# Altium project AM3358_DEV_BOARD.PrjPcb (part 1 of 3)
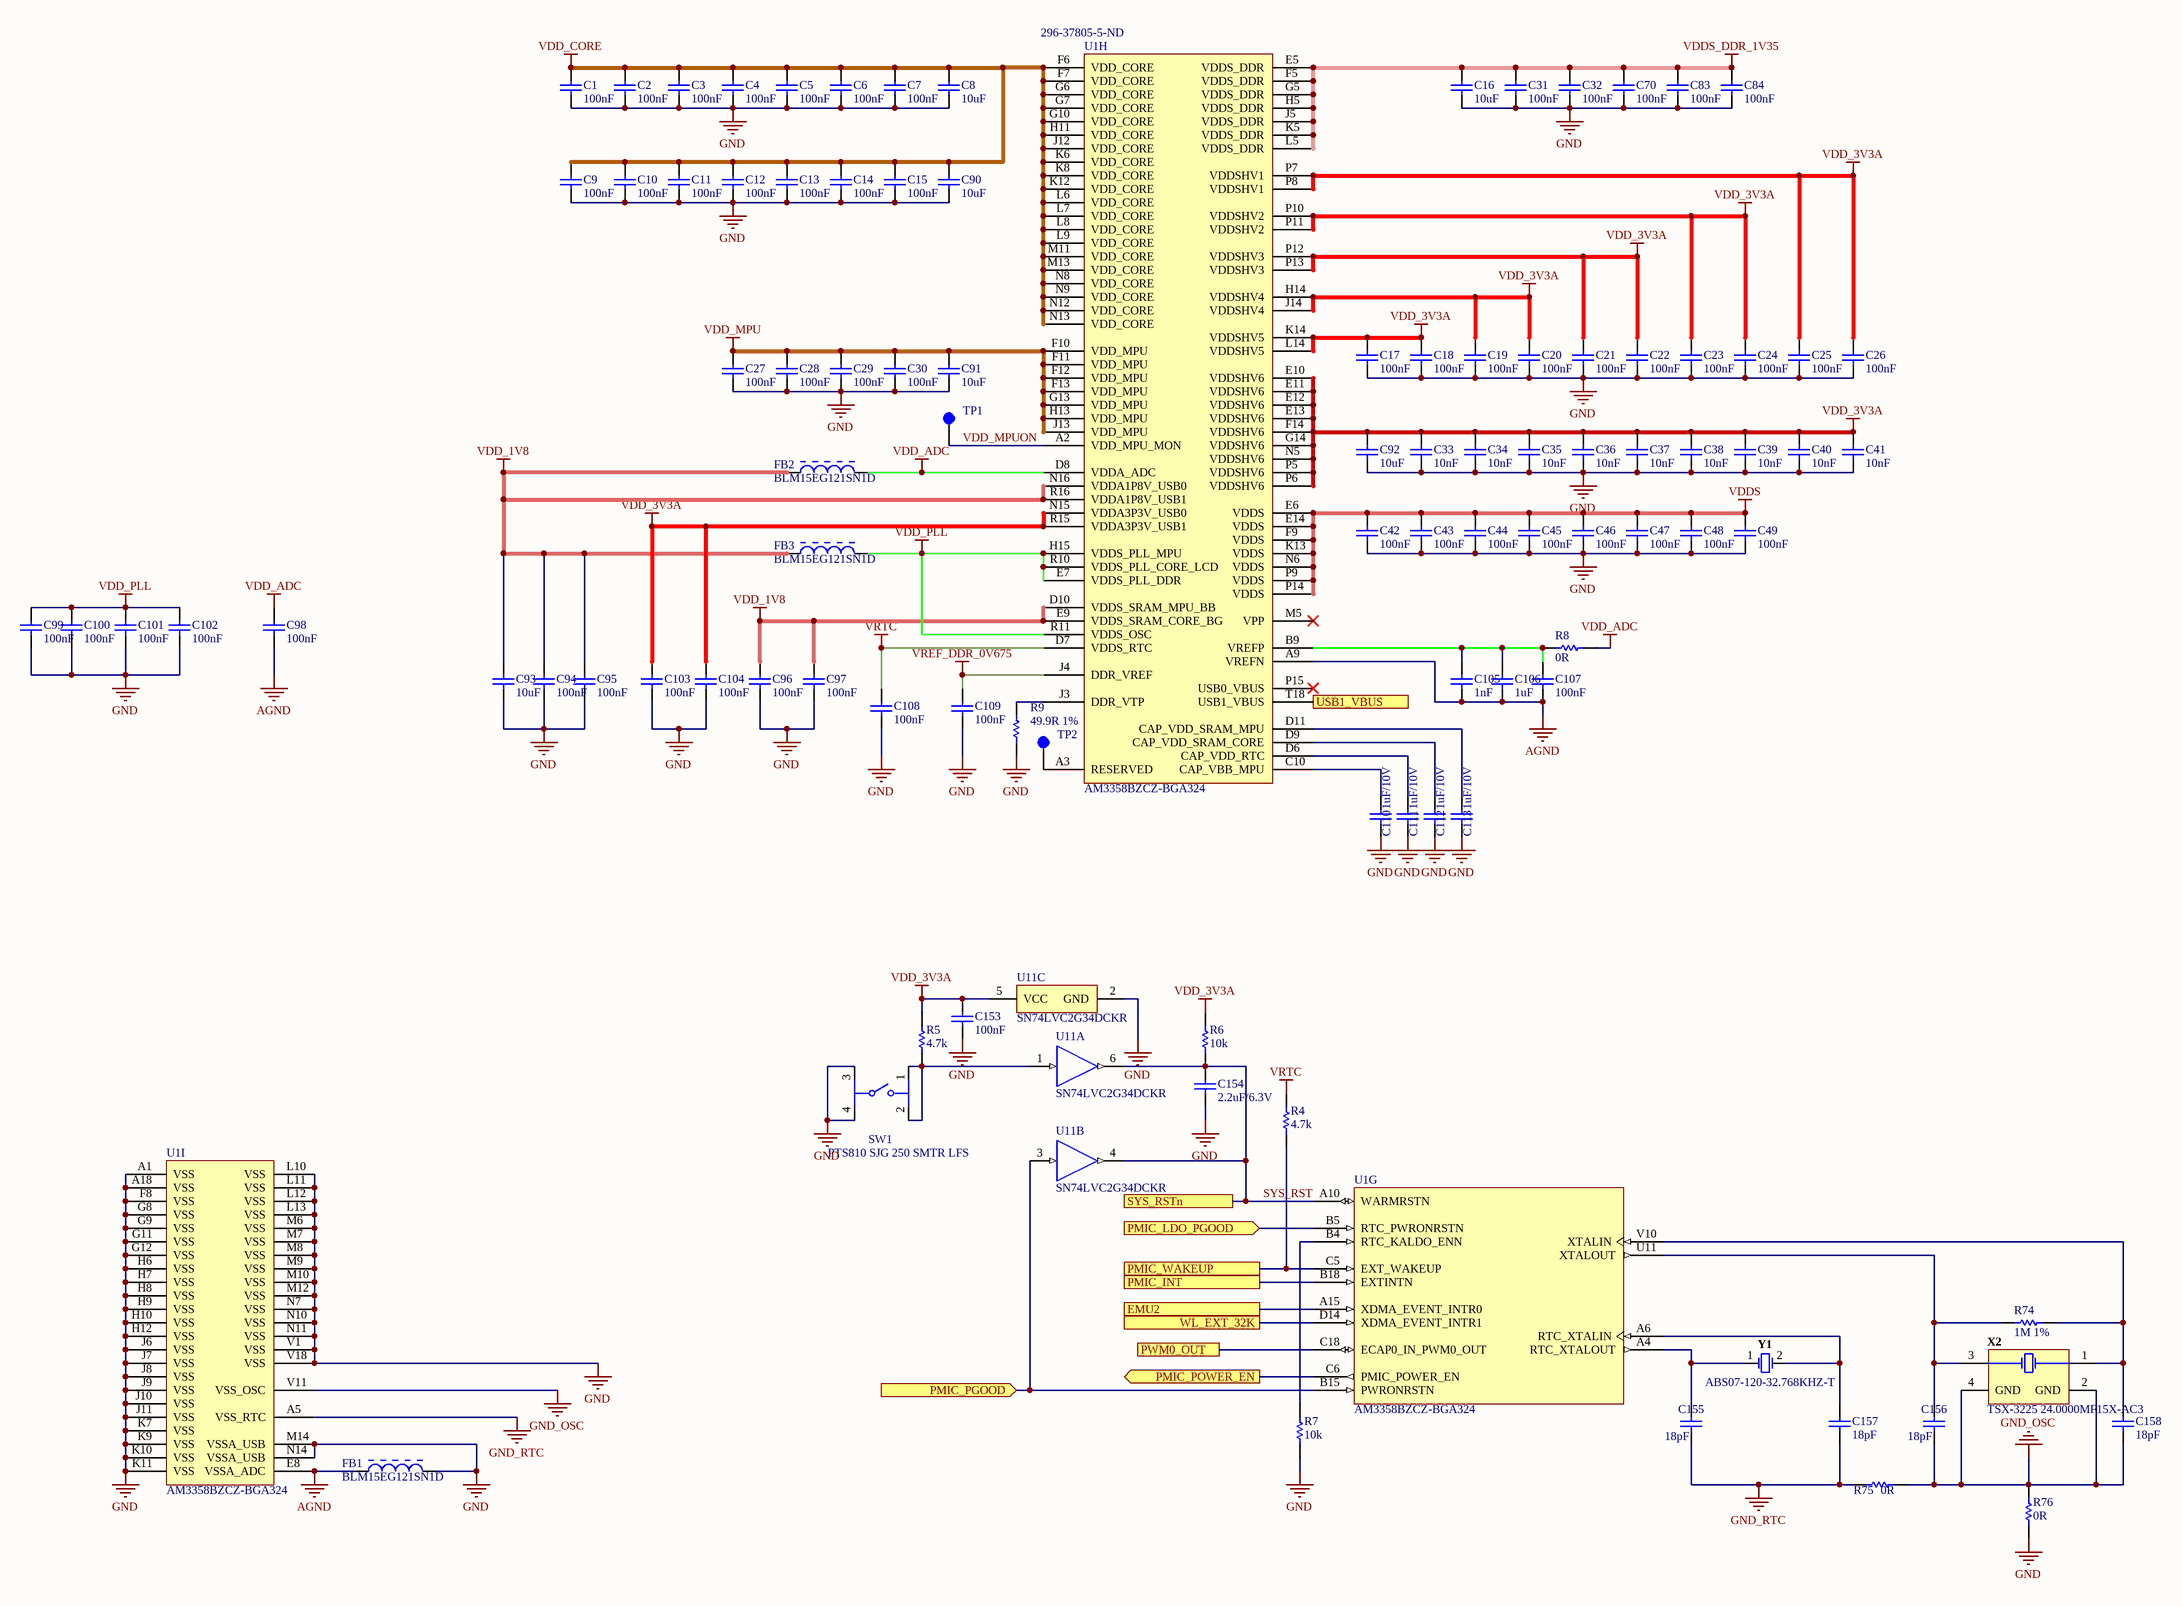
[diagram p0: 03. POWER.SchDoc]
10 sheets, 341 parts. Net scope: flat (ports and power ports of the same name join across sheets).
Board file: AM3358_DEV.PcbDoc
Sheets:
  03. POWER.SchDoc
  04. DDRAM.SchDoc
  05. LCD.SchDoc
  06. ETHERNET.SchDoc
  07. WIFI.SchDoc
  09. SDIO, PERIPHERAL.SchDoc
  08. PMIC.SchDoc
  10. eMMC.SchDoc
  11. USB.SchDoc
  12. uSD.SchDoc

## Sheet 03. POWER.SchDoc
size A2

### Parts
C1  100nF  [CAPC1005X60X30LL05T10]
C2  100nF  [CAPC1005X60X30LL05T10]
C3  100nF  [CAPC1005X60X30LL05T10]
C4  100nF  [CAPC1005X60X30LL05T10]
C5  100nF  [CAPC1005X60X30LL05T10]
C6  100nF  [CAPC1005X60X30LL05T10]
C7  100nF  [CAPC1005X60X30LL05T10]
C8  10uF  [CAPC1005X60X30LL05T10]
C9  100nF  [CAPC1005X60X30LL05T10]
C10  100nF  [CAPC1005X60X30LL05T10]
C11  100nF  [CAPC1005X60X30LL05T10]
C12  100nF  [CAPC1005X60X30LL05T10]
C13  100nF  [CAPC1005X60X30LL05T10]
C14  100nF  [CAPC1005X60X30LL05T10]
C15  100nF  [CAPC1005X60X30LL05T10]
C16  10uF  [CAPC1608X90X35NL10T15]
C17  100nF  [CAPC1005X60X30LL05T10]
C18  100nF  [CAPC1005X60X30LL05T10]
C19  100nF  [CAPC1005X60X30LL05T10]
C20  100nF  [CAPC1005X60X30LL05T10]
C21  100nF  [CAPC1005X60X30LL05T10]
C22  100nF  [CAPC1005X60X30LL05T10]
C23  100nF  [CAPC1005X60X30LL05T10]
C24  100nF  [CAPC1005X60X30LL05T10]
C25  100nF  [CAPC1005X60X30LL05T10]
C26  100nF  [CAPC1005X60X30LL05T10]
C27  100nF  [CAPC1005X60X30LL05T10]
C28  100nF  [CAPC1005X60X30LL05T10]
C29  100nF  [CAPC1005X60X30LL05T10]
C30  100nF  [CAPC1005X60X30LL05T10]
C31  100nF  [CAPC1005X60X30LL05T10]
C32  100nF  [CAPC1005X60X30LL05T10]
C33  10nF  [CAPC1005X60X30LL05T10]
C34  10nF  [CAPC1005X60X30LL05T10]
C35  10nF  [CAPC1005X60X30LL05T10]
C36  10nF  [CAPC1005X60X30LL05T10]
C37  10nF  [CAPC1005X60X30LL05T10]
C38  10nF  [CAPC1005X60X30LL05T10]
C39  10nF  [CAPC1005X60X30LL05T10]
C40  10nF  [CAPC1005X60X30LL05T10]
C41  10nF  [CAPC1005X60X30LL05T10]
C42  100nF  [CAPC1005X60X30LL05T10]
C43  100nF  [CAPC1005X60X30LL05T10]
C44  100nF  [CAPC1005X60X30LL05T10]
C45  100nF  [CAPC1005X60X30LL05T10]
C46  100nF  [CAPC1005X60X30LL05T10]
C47  100nF  [CAPC1005X60X30LL05T10]
C48  100nF  [CAPC1005X60X30LL05T10]
C49  100nF  [CAPC1005X60X30LL05T10]
C70  100nF  [CAPC1005X60X30LL05T10]
C83  100nF  [CAPC1005X60X30LL05T10]
C84  100nF  [CAPC1005X60X30LL05T10]
C90  10uF  [CAPC1005X60X30LL05T10]
C91  10uF  [RESC1005X40X25LL05T05]
C92  10uF  [CAPC1608X90X35NL10T15]
C93  10uF  [CAPC1608X90X35NL10T15]
C94  100nF  [CAPC1005X60X30LL05T10]
C95  100nF  [CAPC1005X60X30LL05T10]
C96  100nF  [CAPC1005X60X30LL05T10]
C97  100nF  [CAPC1005X60X30LL05T10]
C98  100nF  [RESC1005X40X25LL05T05]
C99  100nF  [RESC1005X40X25LL05T05]
C100  100nF  [RESC1005X40X25LL05T05]
C101  100nF  [RESC1005X40X25LL05T05]
C102  100nF  [RESC1005X40X25LL05T05]
C103  100nF  [CAPC1005X60X30LL05T10]
C104  100nF  [CAPC1005X60X30LL05T10]
C105  1nF  [CAPC1005X60X30LL05T10]
C106  1uF  [CAPC1005X55X25NL05T10]
C107  100nF  [CAPC1005X60X30LL05T10]
C108  100nF  [CAPC1005X60X30LL05T10]
C109  100nF  [CAPC1005X60X30LL05T10]
C110  1uF/10V  [CAPC1005X55X25NL05T10]
C111  1uF/10V  [CAPC1005X55X25NL05T10]
C112  1uF/10V  [CAPC1005X55X25NL05T10]
C113  1uF/10V  [CAPC1005X55X25NL05T10]
C153  100nF  [CAPC1005X55X25LL05T10]
C154  2.2uF/6.3V  [CAPC1005X60X30LL05T10]
C155  18pF  [CAPC1005X60X30LL05T10]
C156  18pF  [CAPC1005X60X30LL05T10]
C157  18pF  [CAPC1005X60X30LL05T10]
C158  18pF  [CAPC1005X60X30LL05T10]
FB1  BLM15EG121SN1D  [MURA-BLM15-CHIP-2_V]
FB2  BLM15EG121SN1D  [MURA-BLM15-CHIP-2_V]
FB3  BLM15EG121SN1D  [MURA-BLM15-CHIP-2_V]
R4  4.7k  [RESC1005X40X25LL05T05]
R5  4.7k  [RESC1005X40X25LL05T05]
R6  10k  [RESC1005X40X25LL05T05]
R7  10k  [RESC1005X40X25LL05T05]
R8  0R  [RESC1005X40X25LL05T05]
R9  49.9R 1%  [RESC1005X40X25LL05T05]
R74  1M 1%  [RESC1005X40X25LL05T05]
R75  0R  [RESC1005X40X25LL05T05]
R76  0R  [RESC1005X40X25LL05T05]
SW1  PTS810 SJG 250 SMTR LFS  [FP-PTS810_SJG_250_SMTR_LF-MFG]
TP1  Test Point  [TP]  (value not drawn)
TP2  Test Point  [TP]  (value not drawn)
U1  AM3358BZCZ-BGA324  [TI-ZCZ324]  (parts G,H,I of 11)
U11  SN74LVC2G34DCKR  [DCK0006A_L]  (parts A,B,C of 3)
X2  TSX-3225 24.0000MF15X-AC3  [FP-NX3225SA-MFG]
Y1  ABS07-120-32.768KHZ-T  [ABRA-ABS07_A_V]

### Ports
EMU2, PMIC_INT, PMIC_LDO_PGOOD (in), PMIC_PGOOD (in), PMIC_POWER_EN (out), PMIC_WAKEUP, PWM0_OUT, SYS_RSTn, USB1_VBUS, WL_EXT_32K

### Nets
AGND: C98.1 C105.1 C106.1 C107.1 FB1.1 U1.A9(VREFN) U1.E8(VSSA_ADC)
GND: C1.1 C2.1 C3.1 C4.1 C5.1 C6.1 C7.1 C8.1 C9.1 C10.1 C11.1 C12.1 C13.1 C14.1 C15.1 C16.1 C17.1 C18.1 C19.1 C20.1 C21.1 C22.1 C23.1 C24.1 C25.1 C26.1 C27.1 C28.1 C29.1 C30.1 C31.1 C32.1 C33.1 C34.1 C35.1 C36.1 C37.1 C38.1 C39.1 C40.1 C41.1 C42.1 C43.1 C44.1 C45.1 C46.1 C47.1 C48.1 C49.1 C70.1 C83.1 C84.1 C90.1 C91.1 C92.1 C93.1 C94.1 C95.1 C96.1 C97.1 C99.1 C100.1 C101.1 C102.1 C103.1 C104.1 C108.1 C109.1 C110.1 C111.1 C112.1 C113.1 C153.1 C154.1 FB1.2 R7.1 R9.1 R76.1 SW1.3 SW1.4 U1.A1(VSS) U1.A18(VSS) U1.F8(VSS) U1.G8(VSS) U1.G9(VSS) U1.G11(VSS) U1.G12(VSS) U1.H6(VSS) U1.H7(VSS) U1.H8(VSS) U1.H9(VSS) U1.H10(VSS) U1.H12(VSS) U1.J6(VSS) U1.J7(VSS) U1.J8(VSS) U1.J9(VSS) U1.J10(VSS) U1.J11(VSS) U1.K7(VSS) U1.K9(VSS) U1.K10(VSS) U1.K11(VSS) U1.L10(VSS) U1.L11(VSS) U1.L12(VSS) U1.L13(VSS) U1.M6(VSS) U1.M7(VSS) U1.M8(VSS) U1.M9(VSS) U1.M10(VSS) U1.M12(VSS) U1.M14(VSSA_USB) U1.N7(VSS) U1.N10(VSS) U1.N11(VSS) U1.N14(VSSA_USB) U1.V1(VSS) U1.V18(VSS) U11.2(GND)
GND_OSC: C156.1 C158.1 R75.1 R76.2 U1.V11(VSS_OSC) X2.2(GND) X2.4(GND)
GND_RTC: C155.1 C157.1 R75.2 U1.A5(VSS_RTC)
VDD_1V8: C93.2 C94.2 C95.2 C96.2 C97.2 FB2.1 FB3.1 U1.D10(VDDS_SRAM_MPU_BB) U1.E9(VDDS_SRAM_CORE_BG) U1.N16(VDDA1P8V_USB0) U1.R16(VDDA1P8V_USB1)
VDD_3V3A: C17.2 C18.2 C19.2 C20.2 C21.2 C22.2 C23.2 C24.2 C25.2 C26.2 C33.2 C34.2 C35.2 C36.2 C37.2 C38.2 C39.2 C40.2 C41.2 C92.2 C103.2 C104.2 C153.2 R5.1 R6.2 U1.E10(VDDSHV6) U1.E11(VDDSHV6) U1.E12(VDDSHV6) U1.E13(VDDSHV6) U1.F14(VDDSHV6) U1.G14(VDDSHV6) U1.H14(VDDSHV4) U1.J14(VDDSHV4) U1.K14(VDDSHV5) U1.L14(VDDSHV5) U1.N5(VDDSHV6) U1.N15(VDDA3P3V_USB0) U1.P5(VDDSHV6) U1.P6(VDDSHV6) U1.P7(VDDSHV1) U1.P8(VDDSHV1) U1.P10(VDDSHV2) U1.P11(VDDSHV2) U1.P12(VDDSHV3) U1.P13(VDDSHV3) U1.R15(VDDA3P3V_USB1) U11.5(VCC)
VDD_ADC: C98.2 FB2.2 R8.2 U1.D8(VDDA_ADC)
VDD_CORE: C1.2 C2.2 C3.2 C4.2 C5.2 C6.2 C7.2 C8.2 C9.2 C10.2 C11.2 C12.2 C13.2 C14.2 C15.2 C90.2 U1.F6(VDD_CORE) U1.F7(VDD_CORE) U1.G6(VDD_CORE) U1.G7(VDD_CORE) U1.G10(VDD_CORE) U1.H11(VDD_CORE) U1.J12(VDD_CORE) U1.K6(VDD_CORE) U1.K8(VDD_CORE) U1.K12(VDD_CORE) U1.L6(VDD_CORE) U1.L7(VDD_CORE) U1.L8(VDD_CORE) U1.L9(VDD_CORE) U1.M11(VDD_CORE) U1.M13(VDD_CORE) U1.N8(VDD_CORE) U1.N9(VDD_CORE) U1.N12(VDD_CORE) U1.N13(VDD_CORE)
VDD_MPU: C27.2 C28.2 C29.2 C30.2 C91.2 U1.F10(VDD_MPU) U1.F11(VDD_MPU) U1.F12(VDD_MPU) U1.F13(VDD_MPU) U1.G13(VDD_MPU) U1.H13(VDD_MPU) U1.J13(VDD_MPU)
VDD_PLL: C99.2 C100.2 C101.2 C102.2 FB3.2 U1.E7(VDDS_PLL_DDR) U1.H15(VDDS_PLL_MPU) U1.R10(VDDS_PLL_CORE_LCD) U1.R11(VDDS_OSC)
VDDS: C42.2 C43.2 C44.2 C45.2 C46.2 C47.2 C48.2 C49.2 U1.E6(VDDS) U1.E14(VDDS) U1.F9(VDDS) U1.K13(VDDS) U1.N6(VDDS) U1.P9(VDDS) U1.P14(VDDS)
VDDS_DDR_1V35: C16.2 C31.2 C32.2 C70.2 C83.2 C84.2 U1.E5(VDDS_DDR) U1.F5(VDDS_DDR) U1.G5(VDDS_DDR) U1.H5(VDDS_DDR) U1.J5(VDDS_DDR) U1.K5(VDDS_DDR) U1.L5(VDDS_DDR)
VREF_DDR_0V675: C109.2 U1.J4(DDR_VREF)
VRTC: C108.2 R4.1 U1.D7(VDDS_RTC)
JTAG_EMU2: U1.A15(XDMA_EVENT_INTR0) ; port EMU2
JTAG_EMU3: U1.D14(XDMA_EVENT_INTR1) ; port WL_EXT_32K
SYS_RST: C154.2 R6.1 U1.A10(WARMRSTN) U11.4(2Y) U11.6(1Y) ; port SYS_RSTn  [project net ETH_RST]
VDD_MPUON: TP1.1 U1.A2(VDD_MPU_MON)
NetC105_2: C105.2 C106.2 C107.2 R8.1 U1.B9(VREFP)
NetC110_2: C110.2 U1.C10(CAP_VBB_MPU)
NetC111_2: C111.2 U1.D6(CAP_VDD_RTC)
NetC112_2: C112.2 U1.D9(CAP_VDD_SRAM_CORE)
NetC113_2: C113.2 U1.D11(CAP_VDD_SRAM_MPU)
NetC155_2: C155.2 U1.A4(RTC_XTALOUT) Y1.1
NetC156_2: C156.2 R74.1 U1.U11(XTALOUT) X2.3(X2)
NetC157_2: C157.2 U1.A6(RTC_XTALIN) Y1.2
NetC158_2: C158.2 R74.2 U1.V10(XTALIN) X2.1(X1)
NetFB7_1: U1.T18(USB1_VBUS) ; port USB1_VBUS
NetJ7_38: U1.C18(ECAP0_IN_PWM0_OUT) ; port PWM0_OUT
NetR4_2: R4.2 U1.C5(EXT_WAKEUP) ; port PMIC_WAKEUP
NetR5_2: R5.2 SW1.1 SW1.2 U11.1(1A)
NetR7_2: R7.2 U1.B4(RTC_KALDO_ENN)
NetR9_2: R9.2 U1.J3(DDR_VTP)
NetTP2_1: TP2.1 U1.A3(RESERVED)
NetU1_B5: U1.B5(RTC_PWRONRSTN) ; port PMIC_LDO_PGOOD
NetU1_B15: U1.B15(PWRONRSTN) U11.3(2A) ; port PMIC_PGOOD
NetU1_B18: U1.B18(EXTINTN) ; port PMIC_INT
NetU1_C6: U1.C6(PMIC_POWER_EN) ; port PMIC_POWER_EN

Not connected (* = marked no-connect by the designer): U1 M5(VPP)* P15(USB0_VBUS)*

### Notes on the sheet
- Title
- Size:
- Date:
- Design by:
- A4
- Number:
- Time:
- Check by:
- Revision:
- Sheet
- of
- N.S.T
- https://github.com/tung080827

### Library data of the parts
C1-C7 C9-C15 C17-C32 C42-C49 C70 C83 C84 C94-C104 C107-C109 C153 = CMP-2100-03641-1: Chip Capacitor, 0.1 uF, +/- 10%, 16 V, -55 to 125 degC, 0402 (1005 Metric), RoHS, Tape and Reel; Manufacturer: Murata; Material: Ceramic; Insulation Resistance: 10GR; Voltage: 16V; Dielectric: X7R; REACH SVHC: NoSVHC; Depth: 0.5mm; Case/Package: 0402; Datasheet URL: http://psearch.en.murata.com/capacitor/product/GRM155R71C104KA88%23.pdf; Lead Free: LeadFree; Dielectric Material: Ceramic; Manufacturer URL: http://www.murata.com/; Min Operating Temperature: -55degC; Length: 1mm; Case Code (Metric): 1005; Radiation Hardening: No; Package Reference: 0402; RoHSCompliant: true; Datasheet Version: 42675.0; Thickness: 0.022inch; Packaging: TapeandReel; Voltage Rating (DC): 16V; Tolerance: 10%; Max Operating Temperature: 125degC; Package Description: 2-Pin Surface Mount Device, Body 1 x 0.5 mm; Mount: SurfaceMount; Height: 0.5mm; Width: 0.5mm; Number of Pins: 2; Voltage Rating: 16V; Case Code (Imperial): 0402; Termination: SMD/SMT; Capacitance: 100nF; Package Quantity: 1
C8 C16 C90-C93 = CMP-2006-02792-1: Part Number: GRM188R60J106ME47D; Manufacturer: Murata
C33-C41 = CMP-2100-03641-1: Chip Capacitor, 0.1 uF, +/- 10%, 16 V, -55 to 125 degC, 0402 (1005 Metric), RoHS, Tape and Reel; Manufacturer: Murata; Material: Ceramic; Insulation Resistance: 10GR; Voltage: 16V; Dielectric: X7R; Capacitance: 100nF; REACH SVHC: NoSVHC; Depth: 0.5mm; Case/Package: 0402; Datasheet URL: http://psearch.en.murata.com/capacitor/product/GRM155R71C104KA88%23.pdf; Lead Free: LeadFree; Dielectric Material: Ceramic; Manufacturer URL: http://www.murata.com/; Min Operating Temperature: -55degC; Length: 1mm; Case Code (Metric): 1005; Radiation Hardening: No; Package Reference: 0402; RoHSCompliant: true; Datasheet Version: 42675.0; Thickness: 0.022inch; Packaging: TapeandReel; Voltage Rating (DC): 16V; Tolerance: 10%; Max Operating Temperature: 125degC; Package Description: 2-Pin Surface Mount Device, Body 1 x 0.5 mm; Mount: SurfaceMount; Height: 0.5mm; Width: 0.5mm; Number of Pins: 2; Voltage Rating: 16V; Case Code (Imperial): 0402; Termination: SMD/SMT; Package Quantity: 1
C105 = CMP-2008-04254-1: Part Number: GRM1555C1H102JA01D; Manufacturer: Murata
C106 C110-C113 = CMP-2008-04556-1: Part Number: GRM155R61A105KE15D; Manufacturer: Murata
C154 = CMP-2008-02064-1: Manufacturer: Kemet; Part Number: C0402C225M9PAC7867
C155-C158 = CMP-2008-03918-1: Part Number: GRM1555C1H180JA01D; Manufacturer: Murata
FB1-FB3 = CMP-0686-00148-3: Chip Ferrite Bead for GHz Band General Use (Low DC Resistance Type), 120 Ohm, 1500 mA, -55 to 125 degC, 1 x 0.5 x 0.55 mm SMD, Tape and Reel; Manufacturer: Murata; Rated Current: 1500 mA; Impedance (at 100 MHz): 120 Ohm +/- 25%; DC Resistance: 0.095 Ohm Max.; ComponentLink3URL: http://www.murata.com/products/catalog/pdf/c31e.pdf; ComponentLink1URL: http://www.murata.com/; Packing: Tape and Reel; Operating Temperature Range: -55 to 125 degC; PackageReference: BLM15-2; ComponentLink2Description: Datasheet; PackageDescription: 2-Pin Chip, Body 1 x 0.5 mm; ComponentLink2URL: http://www.murata.com/products/catalog/pdf/c31e.pdf; Mounting Technology: Surface Mount; ComponentLink3Description: Package Specification; ComponentLink1Description: Manufacturer URL; PartNumber: BLM15EG121SN1D; DatasheetVersion: 08/2013
R4 R5 = CMP-2002-07894-1: Part Number: RC0402FR-134K7L; Manufacturer: Yageo
R6 R7 = CMP-2002-08135-1: Manufacturer: Vishay Dale; Part Number: CRCW040210K0FKED
R8 R75 R76 = CMP-2002-07912-1: Manufacturer: Yageo / Phycomp; Part Number: RC0402JR-070RL
R9 = CMP-2002-00969-1: Precision Thick Film Chip Resistors; Manufacturer: Panasonic; Part Number: ERJ-2RKF49R9X
R74 = CMP-2002-00609-3: Chip Resistor, 1 MOhm, +/- 1%, 100 mW, -55 to 155 degC, 0402 (1005 Metric), RoHS, Tape and Reel; PartNumber: ERJ-2RKF1004X; Manufacturer: Basic Passives; Voltage Rating: 50 V; Case\/Package: 0402; Resistance: 1 MOhm; Power Rating: 100 mW; Pins: 2; Max Operating Temperature: 155 degC; ComponentLink2URL: http://industrial.panasonic.com/cdbs/www-data/pdf/RDA0000/AOA0000C86.pdf; Weight: 2.8E-05oz; ComponentLink1URL: http://www.panasonic.com/; Radiation Hardening: No; Height: 0.35 mm; Case Code (Imperial): 0402; ComponentLink2Description: Datasheet; Mount: Surface Mount; ComponentLink1Description: Manufacturer URL; REACH SVHC: Yes; Length: 1 mm; Min Operating Temperature: -55 degC; Width: 0.5 mm; Package Quantity: 10000; Tolerance: 1%; PackageDescription: 2-Pin Surface Mount Device, Body 1 x 0.5 mm; RoHSCompliant: true; DatasheetVersion: 04/2015; PackageReference: 0402; Mounting Technology: Surface Mount; Case Code (Metric): 1005; Packaging: Tape and Reel
SW1 = CMP-10040-000011-1: SWITCH TACTILE SPST-NO 0.05A 16V; Manufacturer: C&K Components; Electromechanical Life: 100000Cycles; Contact Resistance: 500mΩ; Operating Force: 400gf; Current Rating: 50mA; Voltage Rating Dc: 16V; Device Class L2: Switches; Device Class L1: Electromechanical; ComponentLink2URL: https://www.ckswitches.com/media/1476/pts810.pdf; Digikey Description: SWITCH TACTILE SPST-NO 0.05A 16V; RoHS: TRUE; Temperature Range Low: -40°C; Temperature Range High: +85°C; Automotive: No; Category: Switch; ComponentLink2Description: Datasheet; Device Class L3: Tactile Switches; Mouser Description: Switch Tactile N.O. SPST Button J-Bend 0.05A 16VDC 100000Cycles 3.92N SMD T/R; Throw Configuration: SPST-NO; Package: PTS810 SJG 250 SMTR LFS; Height: 2.7mm; Octopart: https://octopart.com/pts810sjg250smtrlfs-c%26k+components-29380277; Manufacturer Part Number: PTS810 SJG 250 SMTR LFS; Temperature: -40°C to +85°C; Lead Free: Yes
TP1 TP2 = TP
U1 = AM3358BZCZ100: Sitara ARM Cortex-A8 32-Bit RISC Microprocessor, 1 GHz, SGX530 3D Graphics Engine, Programmable Real-Time Unit and Industrial Communication Subsystem (PRU-ICSS), 0 to 90 degC, 324-pin NFBGA (ZCZ), Green (RoHS & no Sb/Br); Supplier 1: Digi-Key
U11 = CMP-0859-00474-3: Dual Buffer Gate, DCK0006A, LARGE T&R; Manufacturer: Texas Instruments; Voltage(Nom)(V): 1.8,2.5,3.3,5; Schmitt Trigger: No; Rating: Catalog; Output Type: CMOS; F @ Nom Voltage(Max)(Mhz): 150; Output Drive (IOL/IOH)(Max)(mA): 32/-32; Sub-Family: Non-Inverting Buffer/Driver; Technology Family: LVC; Input Type: CMOS/TTL; ICC @ Nom Voltage(Max)(mA): 0.01; VCC(Min)(V): 1.65; Bits(#): 2; Logic: True; tpd @ Nom Voltage(Max)(ns): 8.6,4.4,4.1,3.2; VCC(Max)(V): 5.5; 3-State Output: No; Operating Temperature Range(C): -40 to 125,-40 to 85; DatasheetVersion: SCES359I; PackageReference: DCK0006A; Generic Part Number: SN74LVC2G34
X2 = CMP-2000-07333-1: MHz Range Crystal, 24 MHz, -40 to 85 degC, 4-Pin SMD, RoHS, Tape and Reel; Manufacturer: Epson; Brand: EpsonTiming; Frequency Stability: 10PPM; Frequency: 24MHz; ESR: 40Ohms; Load Capacitance: 9pF; Unit Weight: 0.000564oz; Drive Level: 200uW; Datasheet Version: 12/2015; RoHS: True; Operating Temperature Range: -40Cto+85C; Length: 3.2mm; Tolerance: 10PPM; Width: 2.5mm; Mounting Technology: SurfaceMount; Package Description: 4-Pin Surface Mount Device, Body 3.2 x 2.5 mm; Manufacturer URL: https://www.eea.epson.com/; Factory Pack Quantity: 250; Package Reference: TSX-3225; Height: 0.6mm; Mounting Style: SMD/SMT; Termination Style: SMD/SMT; Datasheet URL: https://support.epson.biz/td/api/doc_check.php?dl=brief_FA-238V_en.pdf; Type: Crystal; Series: TSX-3225; Package / Case: 3.2mmx2.5mm; Product Category: Crystals; Packaging: Reel
Y1 = CMP-2000-07587-1: Tuning Fork Crystal, 32.768 KHz, +/- 20 ppm, -40 to 85 degC, 2-Pin SMD, RoHS, Tape and Reel; Manufacturer: Abracon; Case\/Package: SMD/SMT; Series Resistance: 60KOhm; Frequency Tolerance: 20ppm; Load Capacitance: 6pF; ESR (Equivalent Series Resistance): 55KOhm; Max Operating Temperature: 85degC; Width: 0.061inch; Radiation Hardening: No; Lead Free: LeadFree; RoHSCompliant: True; Depth: 1.5mm; Datasheet URL: http://www.abracon.com/Resonators/ABS07-120-32.768kHz-T.pdf; Frequency: 32.768KHz; Termination: SMD/SMT; Manufacturer URL: http://www.abracon.com/; Package Quantity: 3000; Packaging: TapeandReel; Number of Pins: 2; Height: 0.035inch; Package Description: 2-Pin Surface Mount Device, Body 3.2 x 1.5 mm; Package Reference: ABS07; Mount: SurfaceMount; Tolerance: 20ppm; Mounting Technology: SurfaceMount; REACH SVHC: NoSVHC; Datasheet Version: 11/2014; Length: 3.2mm; Min Operating Temperature: -40degC

## Sheet 04. DDRAM.SchDoc
size A3
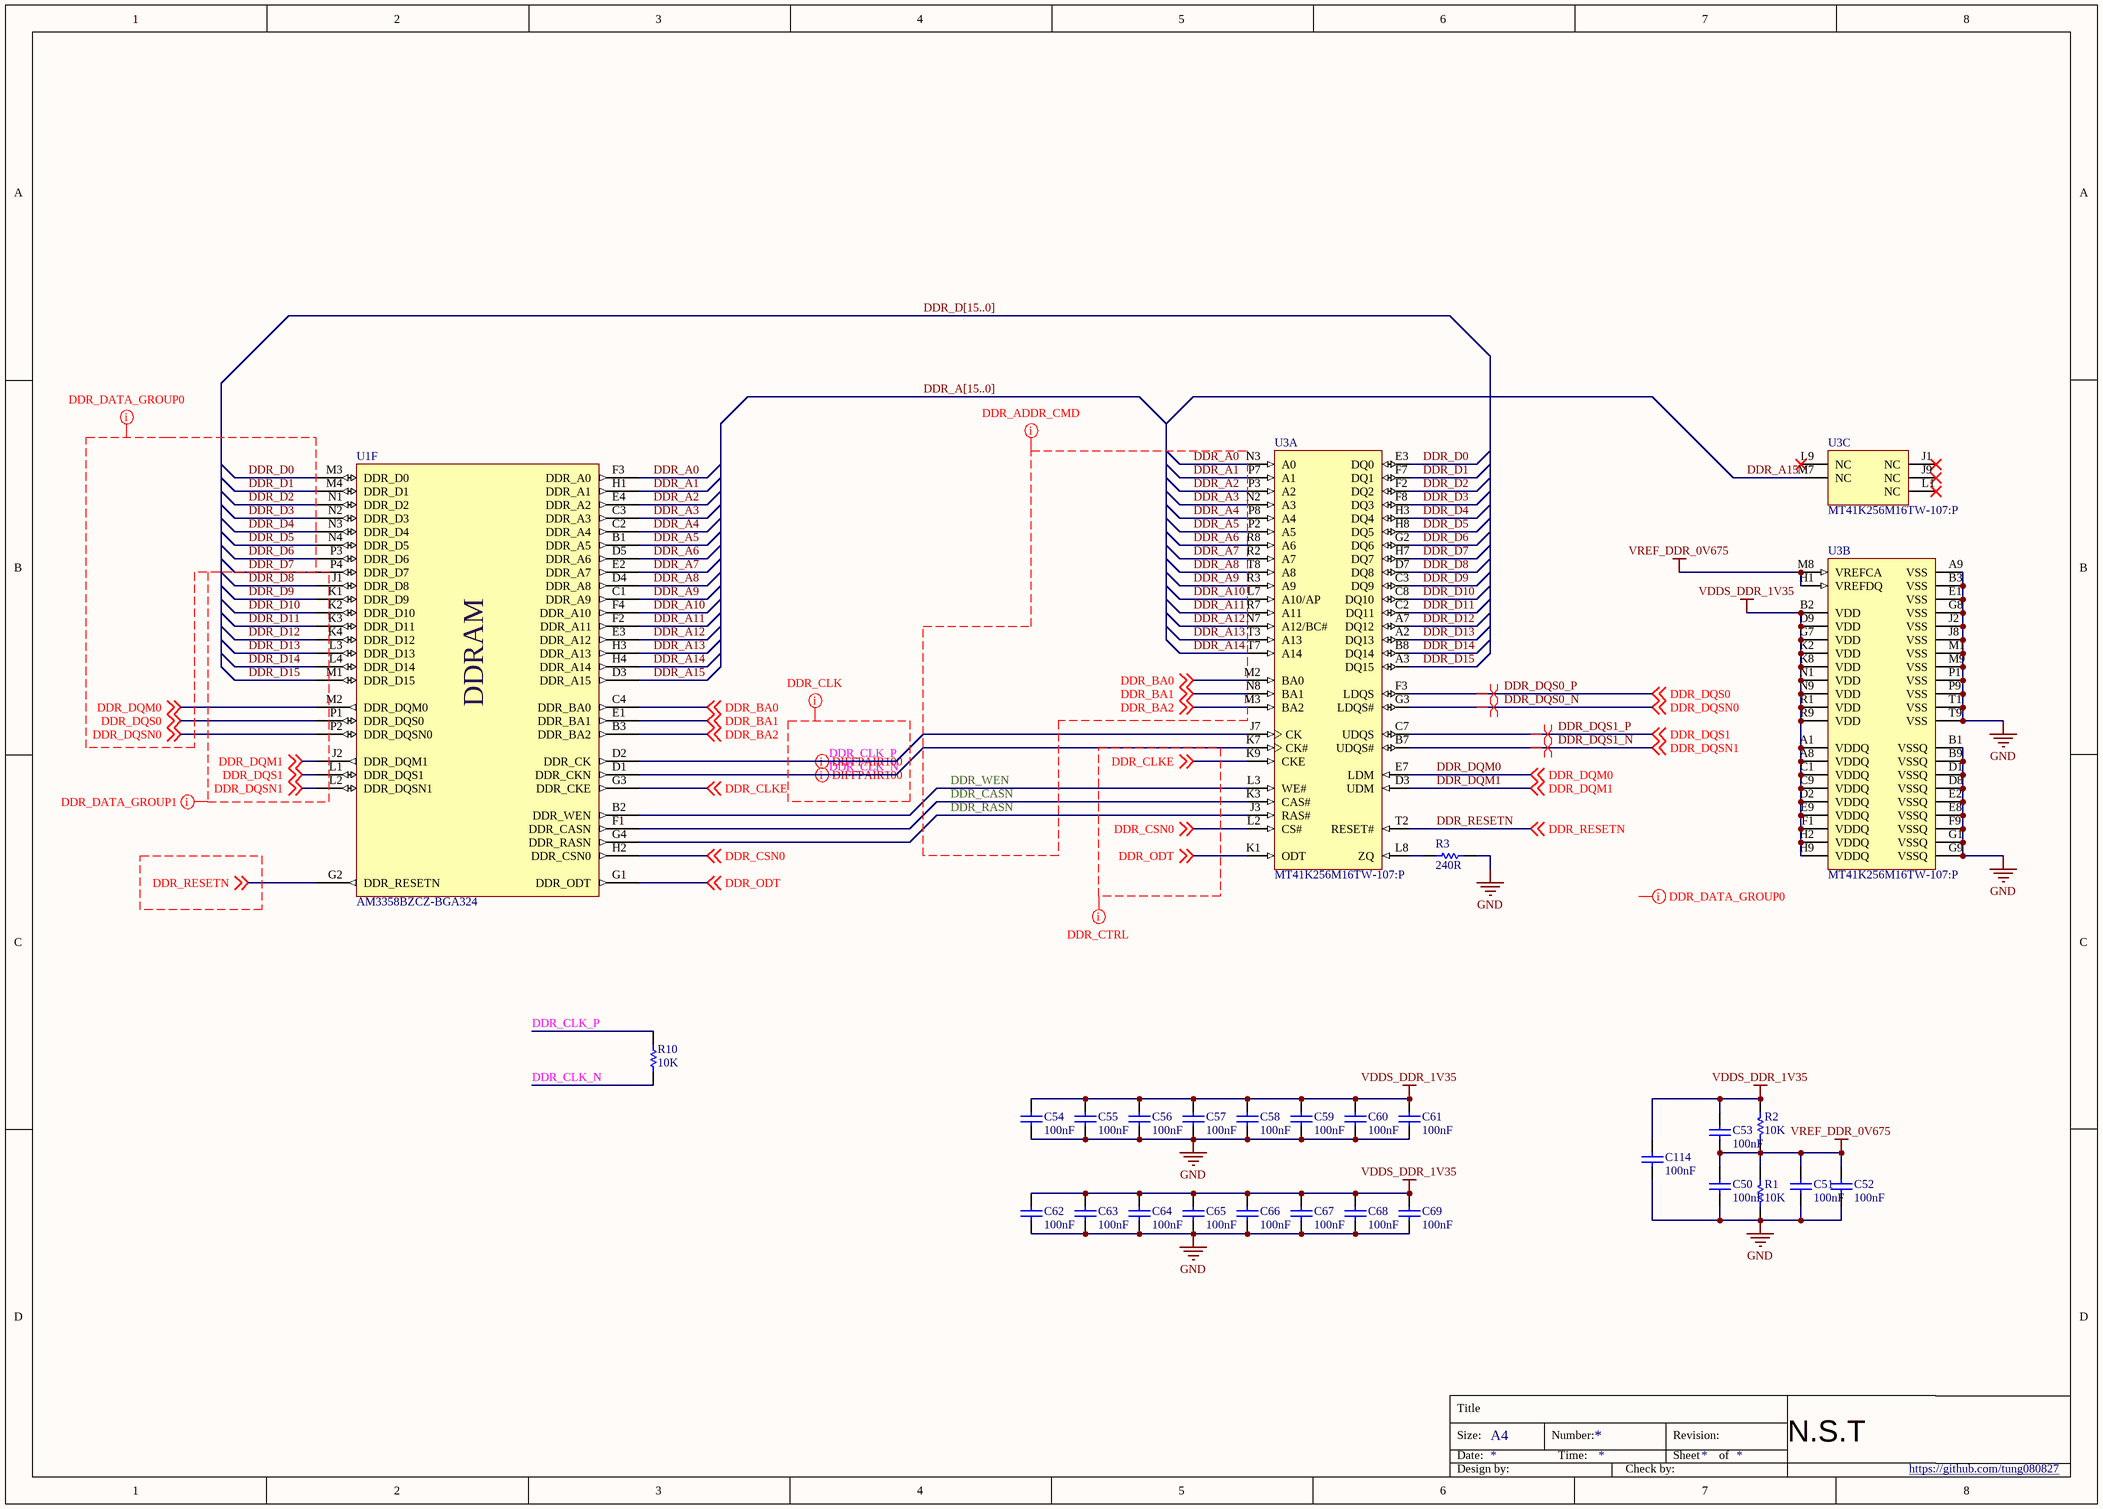
[diagram p1: 04. DDRAM.SchDoc]

### Parts
C50  100nF  [CAPC1005X60X30LL05T10]
C51  100nF  [CAPC1005X60X30LL05T10]
C52  100nF  [CAPC1005X60X30LL05T10]
C53  100nF  [CAPC1005X60X30LL05T10]
C54  100nF  [CAPC1005X60X30LL05T10]
C55  100nF  [CAPC1005X60X30LL05T10]
C56  100nF  [CAPC1005X60X30LL05T10]
C57  100nF  [CAPC1005X60X30LL05T10]
C58  100nF  [CAPC1005X60X30LL05T10]
C59  100nF  [CAPC1005X60X30LL05T10]
C60  100nF  [CAPC1005X60X30LL05T10]
C61  100nF  [CAPC1005X60X30LL05T10]
C62  100nF  [CAPC1005X60X30LL05T10]
C63  100nF  [CAPC1005X60X30LL05T10]
C64  100nF  [CAPC1005X60X30LL05T10]
C65  100nF  [CAPC1005X60X30LL05T10]
C66  100nF  [CAPC1005X60X30LL05T10]
C67  100nF  [CAPC1005X60X30LL05T10]
C68  100nF  [CAPC1005X60X30LL05T10]
C69  100nF  [CAPC1005X60X30LL05T10]
C114  100nF  [CAPC1005X60X30LL05T10]
R1  10K  [RESC1005X40X25LL05T05]
R2  10K  [RESC1005X40X25LL05T05]
R3  240R  [RESC1005X40X25LL05T05]
R10  10K  [RESC1005X40X25ML05T05]
U1  AM3358BZCZ-BGA324  [TI-ZCZ324]  (part F of 11)
U3  MT41K256M16TW-107:P  [MICT-TW-96]  (parts A,B,C of 3)

### Nets
GND: C50.1 C51.1 C52.1 C54.1 C55.1 C56.1 C57.1 C58.1 C59.1 C60.1 C61.1 C62.1 C63.1 C64.1 C65.1 C66.1 C67.1 C68.1 C69.1 C114.1 R1.1 R3.2 U3.A9(VSS) U3.B1(VSSQ) U3.B3(VSS) U3.B9(VSSQ) U3.D1(VSSQ) U3.D8(VSSQ) U3.E1(VSS) U3.E2(VSSQ) U3.E8(VSSQ) U3.F9(VSSQ) U3.G1(VSSQ) U3.G8(VSS) U3.G9(VSSQ) U3.J2(VSS) U3.J8(VSS) U3.M1(VSS) U3.M9(VSS) U3.P1(VSS) U3.P9(VSS) U3.T1(VSS) U3.T9(VSS)
VDDS_DDR_1V35: C53.2 C54.2 C55.2 C56.2 C57.2 C58.2 C59.2 C60.2 C61.2 C62.2 C63.2 C64.2 C65.2 C66.2 C67.2 C68.2 C69.2 C114.2 R2.2 U3.A1(VDDQ) U3.A8(VDDQ) U3.B2(VDD) U3.C1(VDDQ) U3.C9(VDDQ) U3.D2(VDDQ) U3.D9(VDD) U3.E9(VDDQ) U3.F1(VDDQ) U3.G7(VDD) U3.H2(VDDQ) U3.H9(VDDQ) U3.K2(VDD) U3.K8(VDD) U3.N1(VDD) U3.N9(VDD) U3.R1(VDD) U3.R9(VDD)
VREF_DDR_0V675: C50.2 C51.2 C52.2 C53.1 R1.2 R2.1 U3.H1(VREFDQ) U3.M8(VREFCA)
DDR_A0: U1.F3(DDR_A0) U3.N3(A0)
DDR_A1: U1.H1(DDR_A1) U3.P7(A1)
DDR_A2: U1.E4(DDR_A2) U3.P3(A2)
DDR_A3: U1.C3(DDR_A3) U3.N2(A3)
DDR_A4: U1.C2(DDR_A4) U3.P8(A4)
DDR_A5: U1.B1(DDR_A5) U3.P2(A5)
DDR_A6: U1.D5(DDR_A6) U3.R8(A6)
DDR_A7: U1.E2(DDR_A7) U3.R2(A7)
DDR_A8: U1.D4(DDR_A8) U3.T8(A8)
DDR_A9: U1.C1(DDR_A9) U3.R3(A9)
DDR_A10: U1.F4(DDR_A10) U3.L7(A10/AP)
DDR_A11: U1.F2(DDR_A11) U3.R7(A11)
DDR_A12: U1.E3(DDR_A12) U3.N7(A12/BC#)
DDR_A13: U1.H3(DDR_A13) U3.T3(A13)
DDR_A14: U1.H4(DDR_A14) U3.T7(A14)
DDR_A15: U1.D3(DDR_A15) U3.M7(NC)
DDR_BA0: U1.C4(DDR_BA0) U3.M2(BA0) ; off-sheet DDR_BA0
DDR_BA1: U1.E1(DDR_BA1) U3.N8(BA1) ; off-sheet DDR_BA1
DDR_BA2: U1.B3(DDR_BA2) U3.M3(BA2) ; off-sheet DDR_BA2
DDR_CASN: U1.F1(DDR_CASN) U3.K3(CAS#)
DDR_CLK_N: R10.2 U1.D1(DDR_CKN) U3.K7(CK#)
DDR_CLK_P: R10.1 U1.D2(DDR_CK) U3.J7(CK)
DDR_CLKE: U1.G3(DDR_CKE) U3.K9(CKE) ; off-sheet DDR_CLKE
DDR_CSN0: U1.H2(DDR_CSN0) U3.L2(CS#) ; off-sheet DDR_CSN0
DDR_D0: U1.M3(DDR_D0) U3.E3(DQ0)
DDR_D1: U1.M4(DDR_D1) U3.F7(DQ1)
DDR_D2: U1.N1(DDR_D2) U3.F2(DQ2)
DDR_D3: U1.N2(DDR_D3) U3.F8(DQ3)
DDR_D4: U1.N3(DDR_D4) U3.H3(DQ4)
DDR_D5: U1.N4(DDR_D5) U3.H8(DQ5)
DDR_D6: U1.P3(DDR_D6) U3.G2(DQ6)
DDR_D7: U1.P4(DDR_D7) U3.H7(DQ7)
DDR_D8: U1.J1(DDR_D8) U3.D7(DQ8)
DDR_D9: U1.K1(DDR_D9) U3.C3(DQ9)
DDR_D10: U1.K2(DDR_D10) U3.C8(DQ10)
DDR_D11: U1.K3(DDR_D11) U3.C2(DQ11)
DDR_D12: U1.K4(DDR_D12) U3.A7(DQ12)
DDR_D13: U1.L3(DDR_D13) U3.A2(DQ13)
DDR_D14: U1.L4(DDR_D14) U3.B8(DQ14)
DDR_D15: U1.M1(DDR_D15) U3.A3(DQ15)
DDR_DQM0: U1.M2(DDR_DQM0) U3.E7(LDM) ; off-sheet DDR_DQM0
DDR_DQM1: U1.J2(DDR_DQM1) U3.D3(UDM) ; off-sheet DDR_DQM1
DDR_DQS0_N: U1.P2(DDR_DQSN0) U3.G3(LDQS#) ; off-sheet DDR_DQSN0  [also labelled DDR_DQSN0]
DDR_DQS0_P: U1.P1(DDR_DQS0) U3.F3(LDQS) ; off-sheet DDR_DQS0  [also labelled DDR_DQS0]
DDR_DQS1_N: U1.L2(DDR_DQSN1) U3.B7(UDQS#) ; off-sheet DDR_DQSN1  [also labelled DDR_DQSN1]
DDR_DQS1_P: U1.L1(DDR_DQS1) U3.C7(UDQS) ; off-sheet DDR_DQS1  [also labelled DDR_DQS1]
DDR_ODT: U1.G1(DDR_ODT) U3.K1(ODT) ; off-sheet DDR_ODT
DDR_RASN: U1.G4(DDR_RASN) U3.J3(RAS#)
DDR_RESETN: U1.G2(DDR_RESETN) U3.T2(RESET#) ; off-sheet DDR_RESETN
DDR_WEN: U1.B2(DDR_WEN) U3.L3(WE#)
NetR3_1: R3.1 U3.L8(ZQ)

Not connected (* = marked no-connect by the designer): U3 J1(NC)* J9(NC)* L1(NC)* L9(NC)*

### Buses and harness runs
bus DDR_A[15..0]
bus DDR_D[15..0]

### Layout directives
net class DDR_DATA_GROUP0; rule Matched Net Lengths [Tolerance = 10mil]: DDR_D0, DDR_D1, DDR_D2, DDR_D3, DDR_D4, DDR_D5, DDR_D6, DDR_D7, DDR_DQM0, DDR_DQS0, DDR_DQSN0
net class DDR_DATA_GROUP1; rule Matched Net Lengths [Tolerance = 10mil]: DDR_D7, DDR_D8, DDR_D9, DDR_D10, DDR_D11, DDR_D12, DDR_D13, DDR_D14, DDR_D15, DDR_DQM1, DDR_DQS1, DDR_DQSN1
net class DDR_DATA_GROUP0; rule Matched Net Lengths [Tolerance = 20mil]: (no net found under the mark)
net class DDR_ADDR_CMD; rule Matched Net Lengths [Tolerance = 20mil]; Parameter 1: MATCHED LENGTH: DDR_A0, DDR_A1, DDR_A2, DDR_A3, DDR_A4, DDR_A5, DDR_A6, DDR_A7, DDR_A8, DDR_A9, DDR_A10, DDR_A11, DDR_A12, DDR_A13, DDR_A14, DDR_BA0, DDR_BA1, DDR_BA2, DDR_CASN, DDR_RASN, DDR_WEN
net class DDR_CLK: DDR_CLK_N, DDR_CLK_P
net class DDR_CTRL; rule Matched Net Lengths [Tolerance = 20mil]: DDR_CLKE, DDR_CSN0, DDR_ODT
differential pair; differential pair class DDR_CLK_DIFF; rule Matched Net Lengths [Tolerance = 1mil]: DDR_CLK_N, DDR_CLK_P
differential pair; differential pair class DDRDQS_GROUP0; rule Matched Net Lengths [Tolerance = 1mil]: DDR_DQS0_N, DDR_DQS0_P
differential pair; differential pair class DDRDQS_GROUP1; rule Matched Net Lengths [Tolerance = 1mil]: DDR_DQS1_N, DDR_DQS1_P

### Notes on the sheet
- Title
- Size:
- Date:
- A4
- Number:
- Time:
- Revision:
- Sheet
- of
- N.S.T
- Design by:
- Check by:
- https://github.com/tung080827
- (in symbol AM3358BZCZ100, part F) DDRAM

### Library data of the parts
C50-C69 C114 = CMP-2100-03641-1: as C1 on sheet 03. POWER; REACH SVHC: NoSVHC; Depth: 0.5mm; Case/Package: 0402; Datasheet URL: http://psearch.en.murata.com/capacitor/product/GRM155R71C104KA88%23.pdf; Lead Free: LeadFree; Dielectric Material: Ceramic; Manufacturer URL: http://www.murata.com/; Min Operating Temperature: -55degC; Length: 1mm; Case Code (Metric): 1005; Radiation Hardening: No; Package Reference: 0402; RoHSCompliant: true; Datasheet Version: 42675.0; Thickness: 0.022inch; Packaging: TapeandReel; Voltage Rating (DC): 16V; Tolerance: 10%; Max Operating Temperature: 125degC; Package Description: 2-Pin Surface Mount Device, Body 1 x 0.5 mm; Mount: SurfaceMount; Height: 0.5mm; Width: 0.5mm; Number of Pins: 2; Voltage Rating: 16V; Case Code (Imperial): 0402; Termination: SMD/SMT; Capacitance: 100nF; Package Quantity: 1
R1 R2 R10 = CMP-2002-08397-1: SMD Resistor 1K Ohm 1/16W, 1%, 0402; Manufacturer: Vishay Dale; Part Number: CRCW0402240RFKED
R3 = CMP-2002-08397-1: SMD Resistor 240 Ohm 1/16W, 1%, 0402; Manufacturer: Vishay Dale; Part Number: CRCW0402240RFKED
U1 = AM3358BZCZ100: as U1 on sheet 03. POWER; Supplier 1: Digi-Key
U3 = CMP-2000-07475-1: DDR3L SDRAM, 4 GB, 933 MHz, 1.283 to 1.45 V, 0 to 95 degC, 96-Pin FBGA, RoHS, Tray; Manufacturer: Micron; Density: 4Gb; Memory Type: RAM; Access Time: 20ns; Frequency: 933MHz; Address Bus Width: 15b; Interface: Parallel; Data Bus Width: 16b; Mount: SurfaceMount; RoHSCompliant: true; Min Operating Temperature: 0degC; Package Description: 96-Ball Fine Pitch Ball Grid Array, Body 14 x 8 mm, Pitch 0.8 mm; Datasheet URL: https://www.micron.com/~/media/documents/products/data-sheet/dram/ddr3/4gb_ddr3l.pdf; Max Frequency: 933MHz; Contact Plating: Silver; Max Operating Temperature: 95degC; Case\/Package: FBGA; Datasheet Version: Rev. P, 05/2017; Manufacturer URL: http://www.micron.com/; Package Reference: TW-96; Mounting Technology: SurfaceMount

## Sheet 05. LCD.SchDoc
size A4
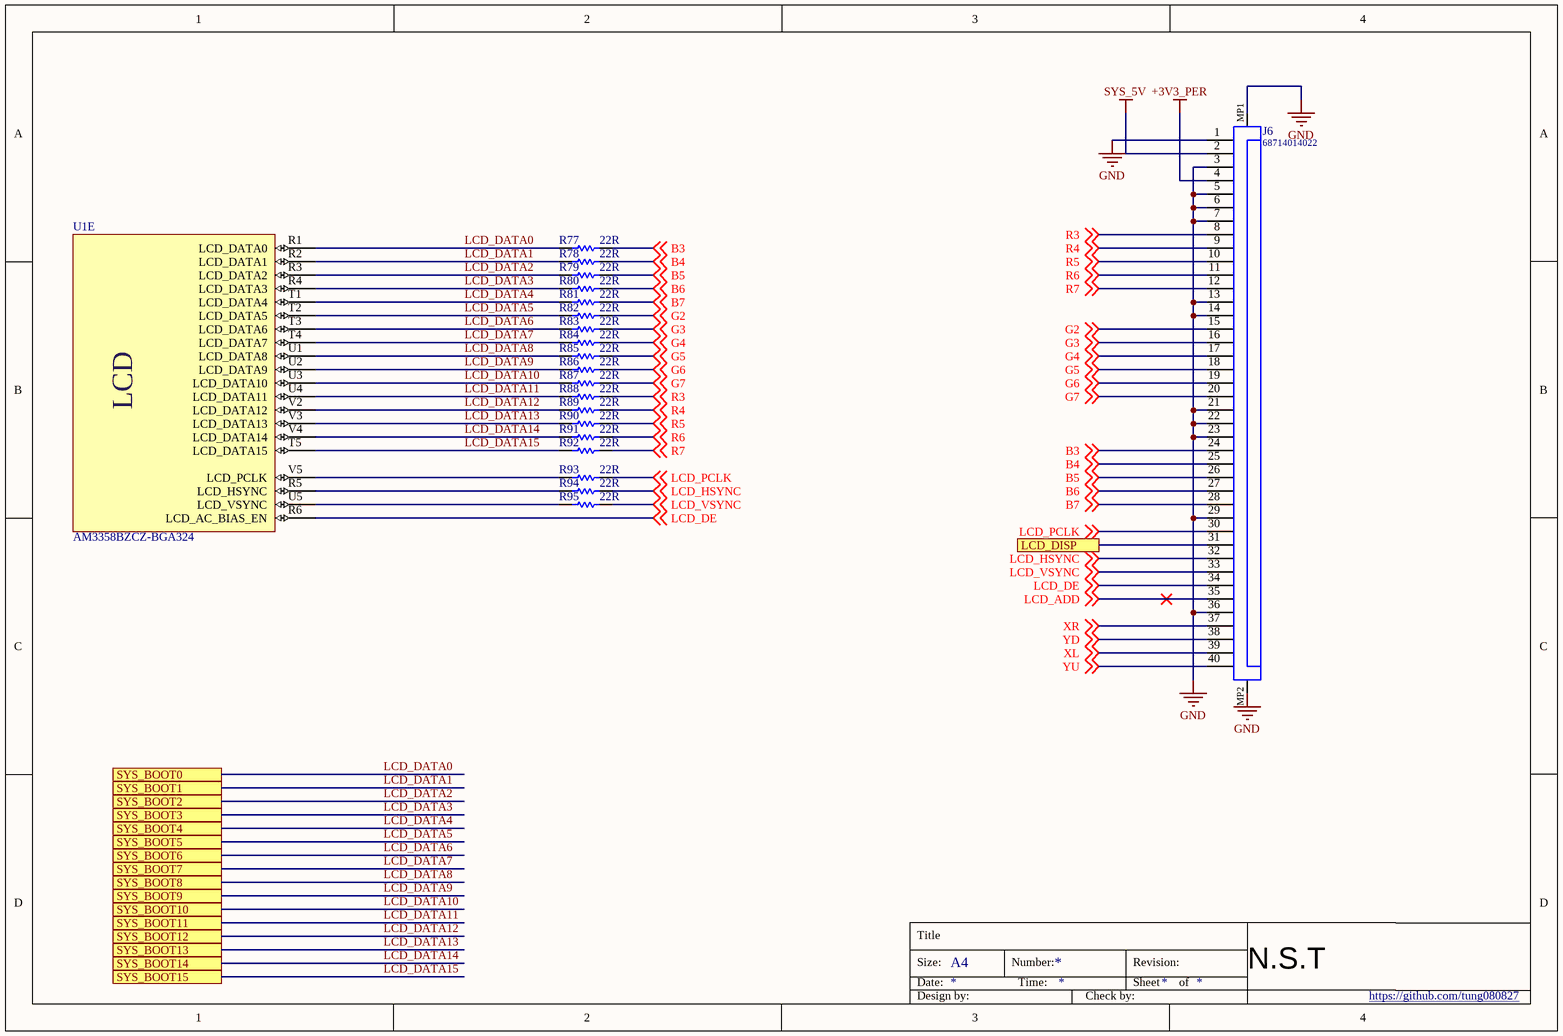
[diagram p2: 05. LCD.SchDoc]

### Parts
J6  68714014022  [68714014022]
R77  22R  [RESC1005X40X25LL05T05]
R78  22R  [RESC1005X40X25LL05T05]
R79  22R  [RESC1005X40X25LL05T05]
R80  22R  [RESC1005X40X25LL05T05]
R81  22R  [RESC1005X40X25LL05T05]
R82  22R  [RESC1005X40X25LL05T05]
R83  22R  [RESC1005X40X25LL05T05]
R84  22R  [RESC1005X40X25LL05T05]
R85  22R  [RESC1005X40X25LL05T05]
R86  22R  [RESC1005X40X25LL05T05]
R87  22R  [RESC1005X40X25LL05T05]
R88  22R  [RESC1005X40X25LL05T05]
R89  22R  [RESC1005X40X25LL05T05]
R90  22R  [RESC1005X40X25LL05T05]
R91  22R  [RESC1005X40X25LL05T05]
R92  22R  [RESC1005X40X25LL05T05]
R93  22R  [RESC1005X40X25LL05T05]
R94  22R  [RESC1005X40X25LL05T05]
R95  22R  [RESC1005X40X25LL05T05]
U1  AM3358BZCZ-BGA324  [TI-ZCZ324]  (part E of 11)

### Ports
LCD_DISP, SYS_BOOT0, SYS_BOOT1, SYS_BOOT2, SYS_BOOT3, SYS_BOOT4, SYS_BOOT5, SYS_BOOT6, SYS_BOOT7, SYS_BOOT8, SYS_BOOT9, SYS_BOOT10, SYS_BOOT11, SYS_BOOT12, SYS_BOOT13, SYS_BOOT14, SYS_BOOT15

### Nets
+3V3_PER: J6.4
GND: J6.1 J6.3 J6.5 J6.6 J6.7 J6.13 J6.14 J6.21 J6.22 J6.23 J6.29 J6.36 J6.MP1 J6.MP2
SYS_5V: J6.2
B3: J6.24 R77.2 ; off-sheet B3
B4: J6.25 R78.2 ; off-sheet B4
B5: J6.26 R79.2 ; off-sheet B5
B6: J6.27 R80.2 ; off-sheet B6
B7: J6.28 R81.2 ; off-sheet B7
G2: J6.15 R82.2 ; off-sheet G2
G3: J6.16 R83.2 ; off-sheet G3
G4: J6.17 R84.2 ; off-sheet G4
G5: J6.18 R85.2 ; off-sheet G5
G6: J6.19 R86.2 ; off-sheet G6
G7: J6.20 R87.2 ; off-sheet G7
GPIO1_28: J6.31 ; port LCD_DISP
LCD_ADD: J6.35 ; off-sheet LCD_ADD
LCD_DATA0: R77.1 U1.R1(LCD_DATA0) ; port SYS_BOOT0
LCD_DATA1: R78.1 U1.R2(LCD_DATA1) ; port SYS_BOOT1
LCD_DATA2: R79.1 U1.R3(LCD_DATA2) ; port SYS_BOOT2
LCD_DATA3: R80.1 U1.R4(LCD_DATA3) ; port SYS_BOOT3
LCD_DATA4: R81.1 U1.T1(LCD_DATA4) ; port SYS_BOOT4
LCD_DATA5: R82.1 U1.T2(LCD_DATA5) ; port SYS_BOOT5
LCD_DATA6: R83.1 U1.T3(LCD_DATA6) ; port SYS_BOOT6
LCD_DATA7: R84.1 U1.T4(LCD_DATA7) ; port SYS_BOOT7
LCD_DATA8: R85.1 U1.U1(LCD_DATA8) ; port SYS_BOOT8
LCD_DATA9: R86.1 U1.U2(LCD_DATA9) ; port SYS_BOOT9
LCD_DATA10: R87.1 U1.U3(LCD_DATA10) ; port SYS_BOOT10
LCD_DATA11: R88.1 U1.U4(LCD_DATA11) ; port SYS_BOOT11
LCD_DATA12: R89.1 U1.V2(LCD_DATA12) ; port SYS_BOOT12
LCD_DATA13: R90.1 U1.V3(LCD_DATA13) ; port SYS_BOOT13
LCD_DATA14: R91.1 U1.V4(LCD_DATA14) ; port SYS_BOOT14
LCD_DATA15: R92.1 U1.T5(LCD_DATA15) ; port SYS_BOOT15
LCD_DE: J6.34 U1.R6(LCD_AC_BIAS_EN) ; off-sheet LCD_DE
LCD_HSYNC: J6.32 R94.2 ; off-sheet LCD_HSYNC
LCD_PCLK: J6.30 R93.2 ; off-sheet LCD_PCLK
LCD_VSYNC: J6.33 R95.2 ; off-sheet LCD_VSYNC
R3: J6.8 R88.2 ; off-sheet R3
R4: J6.9 R89.2 ; off-sheet R4
R5: J6.10 R90.2 ; off-sheet R5
R6: J6.11 R91.2 ; off-sheet R6
R7: J6.12 R92.2 ; off-sheet R7
XL: J6.39 ; off-sheet XL
XR: J6.37 ; off-sheet XR
YD: J6.38 ; off-sheet YD
YU: J6.40 ; off-sheet YU
NetR93_1: R93.1 U1.V5(LCD_PCLK)
NetR94_1: R94.1 U1.R5(LCD_HSYNC)
NetR95_1: R95.1 U1.U5(LCD_VSYNC)

### Notes on the sheet
- Title
- Size:
- Date:
- A4
- Number:
- Time:
- Revision:
- Sheet
- of
- N.S.T
- Design by:
- Check by:
- https://github.com/tung080827
- (in symbol AM3358BZCZ100, part E) LCD

### Library data of the parts
J6 = CMP-1502-01568-1: SMT ZIF Connectors WR-FPC, Horizontal, Top Contact, pitch 0.5 mm, 40 pins; Manufacturer: Wurth Elektronik; Pitch: 0.5mm; Working Voltage: 50VAC; Withstanding Voltage: 250VAC; Pin Number: 40; Contact Resistance: 20mOhm; Rated Current: 0.5A; Package Reference: 68714014022; Operating Temperature: -25to85degC; Packaging: TapeandReel; Datasheet URL: https://katalog.we-online.de/em/datasheet/68714014022.pdf; Mounting Technology: SMT; Part Number: 68714014022; Contact Design: TopContact; Manufacturer URL: http://www.we-online.de; Publisher: WurthElektronik; Orientation: Horizontal
R77-R95 = CMP-1665-00027-3: Chip Resistor, 22 Ohm, +/- 1%, 0.1 W, -55 to 155 degC, 0402 (1005 Metric), RoHS, Tape and Reel; PartNumber: ERJ-2RKF22R0X; Case\/Package: 0402; Resistance: 22 Ohm; Power Rating: 100 mW; Voltage Rating: 50 V; ComponentLink2Description: Datasheet; Packaging: Tape and Reel; Weight: 2.8E-05oz; Pins: 2; Case Code (Imperial): 0402; Width: 0.5 mm; ComponentLink2URL: http://industrial.panasonic.com/cdbs/www-data/pdf/RDA0000/AOA0000C86.pdf; Height: 0.35 mm; PackageReference: 0402; REACH SVHC: Yes; Min Operating Temperature: -55 degC; Length: 1 mm; DatasheetVersion: 04/2015; RoHSCompliant: true; Package Quantity: 10000; Case Code (Metric): 1005; PackageDescription: 2-Pin Surface Mount Device, Body 1 x 0.5 mm; ComponentLink1URL: http://www.panasonic.com/; Mount: Surface Mount; Mounting Technology: Surface Mount; Tolerance: 1%; Max Operating Temperature: 155 degC; ComponentLink1Description: Manufacturer URL
U1 = AM3358BZCZ100: as U1 on sheet 03. POWER; Supplier 1: Digi-Key

## Sheet 06. ETHERNET.SchDoc
size A3
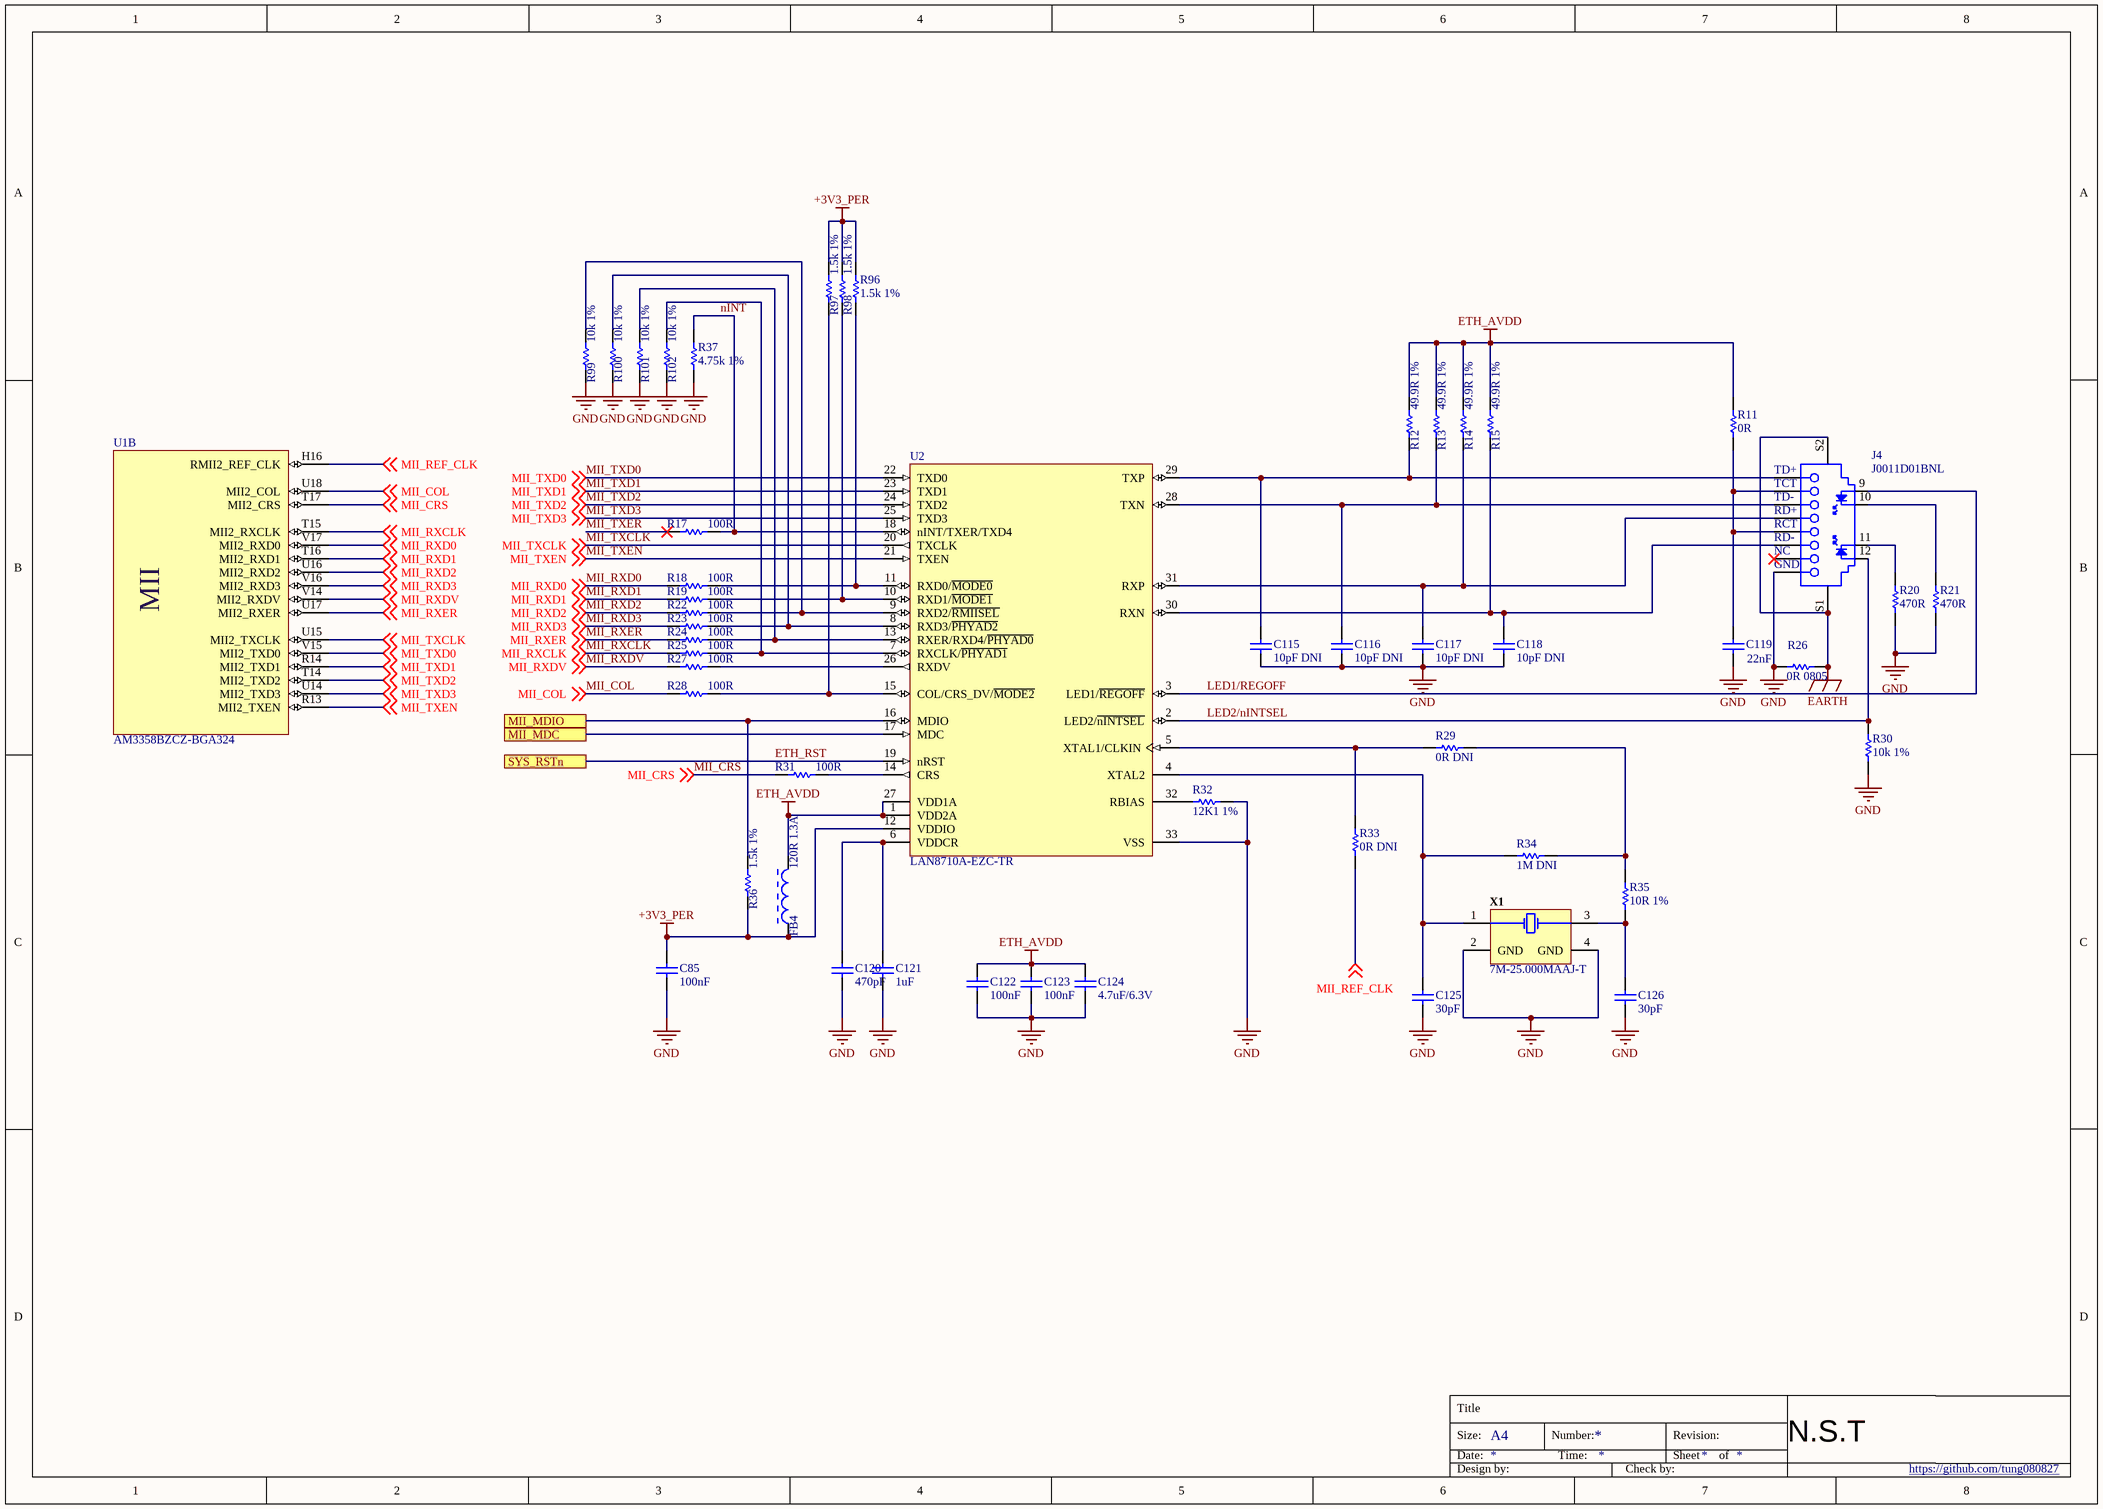
[diagram p3: 06. ETHERNET.SchDoc]

### Parts
C85  100nF  [CAPC1005X60X30LL05T10]
C115  10pF DNI  [CAPC1005X60X30LL05T10]
C116  10pF DNI  [CAPC1005X60X30LL05T10]
C117  10pF DNI  [CAPC1005X60X30LL05T10]
C118  10pF DNI  [CAPC1005X60X30LL05T10]
C119  22nF  [CAPC1005X60X30LL05T10]
C120  470pF  [CAPC1005X60X30LL05T10]
C121  1uF  [CAPC1005X55X25NL05T10]
C122  100nF  [CAPC1005X60X30LL05T10]
C123  100nF  [CAPC1005X60X30LL05T10]
C124  4.7uF/6.3V  [CAPC1005X55X25NL05T10]
C125  30pF  [CAPC1005X60X30LL05T10]
C126  30pF  [CAPC1005X60X30LL05T10]
FB4  120R 1.3A  [MURA-BLM15-CHIP-2_V]
J4  J0011D01BNL  [J0011D01BNL 1PORT 100 BASE-TX]
R11  0R  [RESC1005X40X25LL05T05]
R12  49.9R 1%  [RESC1005X40X25LL05T05]
R13  49.9R 1%  [RESC1005X40X25LL05T05]
R14  49.9R 1%  [RESC1005X40X25LL05T05]
R15  49.9R 1%  [RESC1005X40X25LL05T05]
R17  100R  [RESC1005X40X25LL05T05]
R18  100R  [RESC1005X40X25LL05T05]
R19  100R  [RESC1005X40X25LL05T05]
R20  470R  [RESC1005X40X25LL05T05]
R21  470R  [RESC1005X40X25LL05T05]
R22  100R  [RESC1005X40X25LL05T05]
R23  100R  [RESC1005X40X25LL05T05]
R24  100R  [RESC1005X40X25LL05T05]
R25  100R  [RESC1005X40X25LL05T05]
R26  0R 0805  [RESC2013X50X30LL20T20]
R27  100R  [RESC1005X40X25LL05T05]
R28  100R  [RESC1005X40X25LL05T05]
R29  0R DNI  [RESC1005X40X25LL05T05]
R30  10k 1%  [RESC1005X40X25LL05T05]
R31  100R  [RESC1005X40X25LL05T05]
R32  12K1 1%  [RESC1005X40X25LL05T05]
R33  0R DNI  [RESC1005X40X25LL05T05]
R34  1M DNI  [RESC1005X40X25LL05T05]
R35  10R 1%  [RESC1005X40X25LL05T05]
R36  1.5k 1%  [RESC1005X40X25LL05T05]
R37  4.75k 1%  [RESC1005X40X25LL05T05]
R96  1.5k 1%  [RESC1005X40X25LL05T05]
R97  1.5k 1%  [RESC1005X40X25LL05T05]
R98  1.5k 1%  [RESC1005X40X25LL05T05]
R99  10k 1%  [RESC1005X40X25LL05T05]
R100  10k 1%  [RESC1005X40X25LL05T05]
R101  10k 1%  [RESC1005X40X25LL05T05]
R102  10k 1%  [RESC1005X40X25LL05T05]
U1  AM3358BZCZ-BGA324  [TI-ZCZ324]  (part B of 11)
U2  LAN8710A-EZC-TR  [MCHP-QFN-32-5x5_V1]
X1  7M-25.000MAAJ-T  [FP-NX3225SA-MFG]

### Ports
MII_MDC, MII_MDIO, SYS_RSTn

### Nets
+3V3_PER: C85.2 FB4.1 R36.1 R96.1 R97.2 R98.2 U2.12(VDDIO)
EARTH: J4.S1 J4.S2 R26.2
ETH_AVDD: C122.2 C123.2 C124.2 FB4.2 R11.2 R12.2 R13.2 R14.2 R15.2 U2.1(VDD2A) U2.27(VDD1A)
GND: C85.1 C115.1 C116.1 C117.1 C118.1 C119.1 C120.1 C121.1 C122.1 C123.1 C124.1 C125.1 C126.1 J4.8(GND) R20.1 R21.1 R26.1 R30.1 R32.2 R37.1 R99.1 R100.1 R101.1 R102.1 U2.33(VSS) X1.2(GND) X1.4(GND)
ETH_RST: U2.19(nRST) ; port SYS_RSTn
LED1/REGOFF: J4.9 U2.3(LED1/~{REGOFF})
LED2/nINTSEL: J4.12 R30.2 U2.2(LED2/~{nINTSEL})
MII_COL: R28.1 U1.U18(MII2_COL) ; off-sheet MII_COL
MII_CRS: R31.1 U1.T17(MII2_CRS) ; off-sheet MII_CRS
MII_REF_CLK: R33.1 U1.H16(RMII2_REF_CLK) ; off-sheet MII_REF_CLK
MII_RXCLK: R25.1 U1.T15(MII2_RXCLK) ; off-sheet MII_RXCLK
MII_RXD0: R18.1 U1.V17(MII2_RXD0) ; off-sheet MII_RXD0
MII_RXD1: R19.1 U1.T16(MII2_RXD1) ; off-sheet MII_RXD1
MII_RXD2: R22.1 U1.U16(MII2_RXD2) ; off-sheet MII_RXD2
MII_RXD3: R23.1 U1.V16(MII2_RXD3) ; off-sheet MII_RXD3
MII_RXDV: R27.1 U1.V14(MII2_RXDV) ; off-sheet MII_RXDV
MII_RXER: R24.1 U1.U17(MII2_RXER) ; off-sheet MII_RXER
MII_TXCLK: U1.U15(MII2_TXCLK) U2.20(TXCLK) ; off-sheet MII_TXCLK
MII_TXD0: U1.V15(MII2_TXD0) U2.22(TXD0) ; off-sheet MII_TXD0
MII_TXD1: U1.R14(MII2_TXD1) U2.23(TXD1) ; off-sheet MII_TXD1
MII_TXD2: U1.T14(MII2_TXD2) U2.24(TXD2) ; off-sheet MII_TXD2
MII_TXD3: U1.U14(MII2_TXD3) U2.25(TXD3) ; off-sheet MII_TXD3
MII_TXEN: U1.R13(MII2_TXEN) U2.21(TXEN) ; off-sheet MII_TXEN
MII_TXER: R17.1
nINT: R17.2 R37.2 U2.18(nINT/TXER/TXD4)
NetC115_2: C115.2 J4.1(TD+) R12.1 U2.29(TXP)
NetC116_2: C116.2 J4.3(TD-) R13.1 U2.28(TXN)
NetC117_2: C117.2 J4.4(RD+) R14.1 U2.31(RXP)
NetC118_2: C118.2 J4.6(RD-) R15.1 U2.30(RXN)
NetC119_2: C119.2 J4.2(TCT) J4.5(RCT) R11.1
NetC120_2: C120.2 C121.2 U2.6(VDDCR)
NetC125_2: C125.2 R34.1 U2.4(XTAL2) X1.1(X1)
NetC126_2: C126.2 R35.1 X1.3(X2)
NetJ4_10: J4.10 R21.2
NetJ4_11: J4.11 R20.2
NetR18_2: R18.2 R96.2 U2.11(RXD0/~{MODE0})
NetR19_2: R19.2 R98.1 U2.10(RXD1/~{MODE1})
NetR22_2: R22.2 R99.2 U2.9(RXD2/~{RMIISEL})
NetR23_2: R23.2 R100.2 U2.8(RXD3/~{PHYAD2})
NetR24_2: R24.2 R101.2 U2.13(RXER/RXD4/~{PHYAD0})
NetR25_2: R25.2 R102.2 U2.7(RXCLK/~{PHYAD1})
NetR27_2: R27.2 U2.26(RXDV)
NetR28_2: R28.2 R97.1 U2.15(COL/CRS_DV/~{MODE2})
NetR29_1: R29.1 R33.2 U2.5(XTAL1/CLKIN)
NetR29_2: R29.2 R34.2 R35.2
NetR31_2: R31.2 U2.14(CRS)
NetR32_1: R32.1 U2.32(RBIAS)
NetR36_2: R36.2 U2.16(MDIO) ; port MII_MDIO
NetU1_M18: U2.17(MDC) ; port MII_MDC

Not connected (* = marked no-connect by the designer): J4 7(NC)*

### Notes on the sheet
- Title
- Size:
- Date:
- A4
- Number:
- Time:
- Revision:
- Sheet
- of
- N.S.T
- Design by:
- Check by:
- https://github.com/tung080827
- (in symbol AM3358BZCZ100, part B) MII

### Library data of the parts
C85 C122 C123 = CMP-2100-03641-1: as C1 on sheet 03. POWER; REACH SVHC: NoSVHC; Depth: 0.5mm; Case/Package: 0402; Datasheet URL: http://psearch.en.murata.com/capacitor/product/GRM155R71C104KA88%23.pdf; Lead Free: LeadFree; Dielectric Material: Ceramic; Manufacturer URL: http://www.murata.com/; Min Operating Temperature: -55degC; Length: 1mm; Case Code (Metric): 1005; Radiation Hardening: No; Package Reference: 0402; RoHSCompliant: true; Datasheet Version: 42675.0; Thickness: 0.022inch; Packaging: TapeandReel; Voltage Rating (DC): 16V; Tolerance: 10%; Max Operating Temperature: 125degC; Package Description: 2-Pin Surface Mount Device, Body 1 x 0.5 mm; Mount: SurfaceMount; Height: 0.5mm; Width: 0.5mm; Number of Pins: 2; Voltage Rating: 16V; Case Code (Imperial): 0402; Termination: SMD/SMT; Capacitance: 100nF; Package Quantity: 1
C115-C118 = CMP-2008-03971-1: Manufacturer: Murata; Part Number: GRM1555C1E100JA01D
C119 = CMP-2008-04654-1: Part Number: GRM155R71H223KA12D; Manufacturer: Murata
C120 = CMP-1034-01502-1: CAP 470pF 50V ±10% 0402 (1005 Metric) Thickness 0.6mm SMD; Case-Metric: 1005; Tolerance: Â±10%; Case-EIA: 0402; Technology: SMT; Value: 470pF; Max Thickness: 0.6 mm; Rated Voltage: 50 V
C121 = CMP-2008-04556-1: as C106 on sheet 03. POWER
C124 = CMP-2008-04549-1: Part Number: GRM155R60J475ME47D; Manufacturer: Murata
C125 C126 = CMP-2008-04333-1: Part Number: GRM1555C1H300JA01D; Manufacturer: Murata
FB4 = CMP-0686-00281-3: Chip Ferrite Bead for Power Lines, 120 Ohm, 1300 mA, -55 to 125 degC, 1 x 0.5 x 0.55 mm SMD, Tape and Reel; PartNumber: BLM15PD121SN1D; Manufacturer: Murata; DC Resistance: 0.09 Ohm Max.; Rated Current: 1300 mA; Impedance (at 100 MHz): 120 Ohm +/- 25%; ComponentLink1URL: http://www.murata.com/; DatasheetVersion: 08/2013; Operating Temperature Range: -55 to 125 degC; ComponentLink2Description: Datasheet; Mounting Technology: Surface Mount; PackageReference: BLM15-2; ComponentLink2URL: http://www.murata.com/products/catalog/pdf/c31e.pdf; ComponentLink3URL: http://www.murata.com/products/catalog/pdf/c31e.pdf; ComponentLink3Description: Package Specification; ComponentLink1Description: Manufacturer URL; Packing: Tape and Reel; PackageDescription: 2-Pin Chip, Body 1 x 0.5 mm
J4 = CMP-2000-06492-1: RJ45 Connector, Pitch 1.27 mm, 12 Position, Height 13.84 mm, Tail Length 3.3 mm, 0 to 70 degC, RoHS, Tray; Manufacturer: Pulse Electronics; Dynamic Catalog: PULSEJACK™J0andJ2Series; Shield Material: Brass; Shielding: Shielded; LED Color: Green-Yellow; Number of Ports: 1; Number of Cores per Jack: 4; Catalog Drawings: PULSEJACKRightAngle1x1; Other Names: 553-1483 / J0011D01BNL-ND; Tab Direction: Down; Package Description: RJ45 Connector, Pitch 1.27 mm, 12 Position, Height 13.84 mm, Tail Length 3.3 mm; Number of Rows: 1; Contact Finish Thickness: 15µin(0.38µm); Datasheet URL: http://productfinder.pulseeng.com/products/datasheets/J403.pdf; Connector Type: RJ45; Mounting Type: ThroughHole; Package Reference: J0-A; Orientation: 90°Angle(Right); Termination: Solder; Datasheet Version: Rev. K, 08/2012; Applications: 10/100Base-TX,AutoMDIX; Series: PULSEJACK™J0; Contact Finish: Gold; Height Above Board: 0.545"(13.84mm); Operating Temperature: 0°C~70°C; Packaging: Tray; Contact Material: PhosphorBronze; Standard Package: 30; Housing Material: Thermoplastic; Features: BoardGuide; Category: Connectors,Interconnects; Mounting Technology: ThroughHole; Manufacturer URL: http://www.pulseelectronics.com/; Family: ModularConnectors-JacksWithMagnetics
R11 R35 = CMP-2002-03046-1: Part Number: CRCW040210R0FKEDHP; Manufacturer: Vishay Dale
R12-R15 = CMP-2002-00969-1: as R9 on sheet 03. POWER
R17-R19 R22-R25 R27 R28 R31 = CMP-2002-00431-1: Manufacturer: Panasonic; Part Number: ERJ-2GEJ101X
R20 R21 = CMP-2000-03373-1: Part Number: CRCW0603470RFKEA; Manufacturer: Vishay Dale
R26 = CMP-2001-04896-1: Manufacturer: Vishay Dale; Part Number: CRCW08050000Z0EA
R29 R33 = CMP-2002-07912-1: as R8 on sheet 03. POWER
R30 = CMP-2002-08135-1: as R6 on sheet 03. POWER
R32 = CMP-1011-00632-1: 12K1 0.063W 1% 0402 (1005 Metric)  SMD; Case-EIA: 0402; Value: 12100.00 Ohm; Case-Metric: 1005; Power: 0.063 W; Tolerance: 1 %; Technology: SMT
R34 = CMP-2002-00609-3: as R74 on sheet 03. POWER; Pins: 2; Max Operating Temperature: 155 degC; ComponentLink2URL: http://industrial.panasonic.com/cdbs/www-data/pdf/RDA0000/AOA0000C86.pdf; Weight: 2.8E-05oz; ComponentLink1URL: http://www.panasonic.com/; Radiation Hardening: No; Height: 0.35 mm; Case Code (Imperial): 0402; ComponentLink2Description: Datasheet; Mount: Surface Mount; ComponentLink1Description: Manufacturer URL; REACH SVHC: Yes; Length: 1 mm; Min Operating Temperature: -55 degC; Width: 0.5 mm; Package Quantity: 10000; Tolerance: 1%; PackageDescription: 2-Pin Surface Mount Device, Body 1 x 0.5 mm; RoHSCompliant: true; DatasheetVersion: 04/2015; PackageReference: 0402; Mounting Technology: Surface Mount; Case Code (Metric): 1005; Packaging: Tape and Reel
R36 R96-R98 = CMP-2002-02933-1: Manufacturer: Yageo; Part Number: RT0402BRD071K5L
R37 = CMP-2002-00054-1: Manufacturer: Vishay Dale; Part Number: CRCW04024K75FKED
R99-R102 = CMP-2002-08135-1: 10k 0.063W 1% 0402 (1005 Metric)  SMD; Manufacturer: Vishay Dale; Part Number: CRCW040210K0FKED
U1 = AM3358BZCZ100: as U1 on sheet 03. POWER; Supplier 1: Digi-Key
U2 = CMP-0186-00334-1: Small Footprint, Low Power Consumption, Full-Featured MII/RMII 10/100 Ethernet Transceiver with HP, 1.6 to 3.6 V, 0 to 85 degC, 32-Pin QFN, RoHS, Tape and Reel; Manufacturer: Microchip; Downstream Ports: Ethernet x1; LEDs: 4; Op. Voltage (V): 3.3; ComponentLink3Description: Package Specification; PartNumber: LAN8710A-EZC-TR; Interface (UpStream): MII/RMII; DatasheetVersion: Rev. 1.4; Mounting Technology: Surface Mount; ComponentLink3URL: http://ww1.microchip.com/downloads/en/DeviceDoc/8710a.pdf; Packing: Tape and Reel; Temperature Range (degC): 0 to 85; ComponentLink2URL: http://ww1.microchip.com/downloads/en/DeviceDoc/8710a.pdf; ComponentLink1Description: Manufacturer URL; PackageVersion: Rev. 1.4; RoHS: TRUE; PackageReference: QFN-32; ComponentLink1URL: http://www.microchip.com/; PackageDescription: 32-Pin Quad Flat No-lead Package, Body 5 x 5 mm, Pitch 0.5 mm; Flexible I/O Voltage (V): 1.6 to 3.6; ComponentLink2Description: Datasheet
X1 = CMP-2000-05694-1: SMD Seam Sealing Crystal, 25 MHz, +/- 30 ppm, 18 pF, -20 to 70 degC, 4-Pin SMD, RoHS, Tape and Reel; Manufacturer: TXC; Other Names: 7M25000MAAJT / 887-1132-2; Frequency Tolerance: ±30ppm; Catalog Drawings: 7MSeriesTop7MSeriesBottom7MSeriesSide7MSeriesCircuit; Online Catalog: 7MSeries; Operating Mode: Fundamental; ESR (Equivalent Series Resistance): 60Ohm; EDA / CAD Models: DownloadfromAcceleratedDesigns; Frequency: 25MHz; Load Capacitance: 18pF; Operating Temperature: -20°C~70°C; Size / Dimension: 0.126"Lx0.098"W(3.20mmx2.50mm); Frequency Stability: ±30ppm; Datasheet URL: http://www.txccrystal.com/images/pdf/7m.pdf; Category: CrystalsandOscillators; Series: 7M; Package Description: 4-Pin Surface Mount Device, Body 3.2 x 2.5 mm; Packaging: Tape&Reel(TR); Mounting Technology: SurfaceMount; Standard Package: 3,000; Family: Crystals; Package / Case: 4-SMD,NoLead(DFN,LCC); Height: 0.031"(0.80mm); Type: MHzCrystal; Manufacturer URL: http://www.txccorp.com/; Datasheet Version: 01/2014; Mounting Type: SurfaceMount; Package Reference: 7M-4